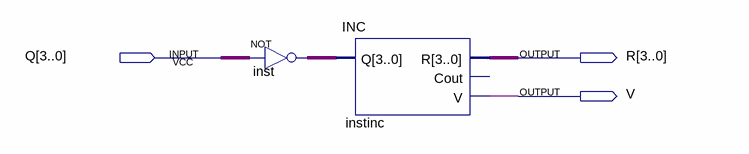
[diagram p0: schematic sheet]
// Quartus schematic CA2.bdf as structural Verilog: 2 symbols, 3 pins
module CA2 (
  input  [3:0] Q,
  output [3:0] R,
  output V
);

  wire [3:0] inst_out;

  assign inst_out = ~Q;  // NOT inst, 4 bits wide
  INC instinc (.Q(inst_out), .R(R), .V(V));  // open: Cout
endmodule
